# Altium schematic sheet PIC-ICSP-RST.SchDoc
size A4
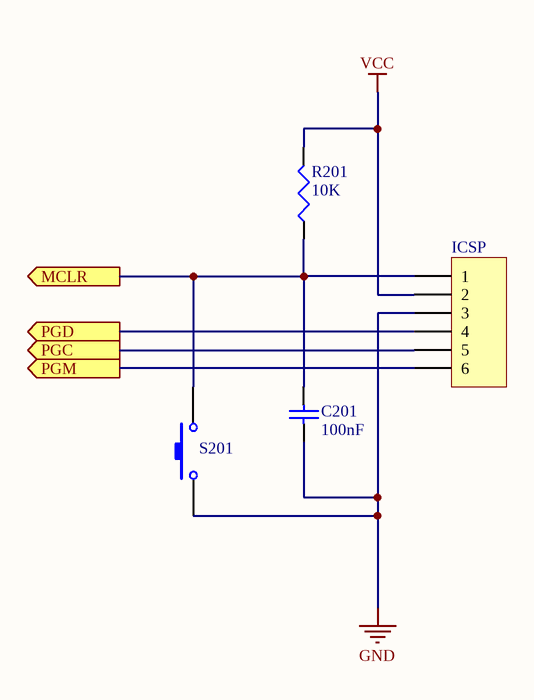
[diagram p0: PIC-ICSP-RST.SchDoc]

## Parts
C201  value 100nF  [RCL 0805]  (hidden comment: Cap Semi)
ICSP  Header 6  [MOLEX 22-23-2061]  (value not drawn)
R201  value 10K  [RCL 0805]  (hidden comment: Res3)
S201  Reset Switch  [Square SMD Switch 01]  (value not drawn)

## Ports
MCLR (out), PGC (out), PGD (out), PGM (out)

## Nets
GND: C201.1 ICSP.3 S201.1
VCC: ICSP.2 R201.2
MCLR: C201.2 ICSP.1 R201.1 S201.2 ; port MCLR
PGC: ICSP.5 ; port PGC
PGD: ICSP.4 ; port PGD
PGM: ICSP.6 ; port PGM

## Library data of the parts
C201 = Cap Semi: Capacitor (Semiconductor SIM Model); Published: 8-Jun-2000; LatestRevisionDate: 29-May-2009; LatestRevisionNote: IPC-7351 Footprint Added.; PackageReference: C1206; Publisher: Altium Limited; PackageDescription: Chip Capacitor
ICSP = Header 6: Header, 6-Pin; LatestRevisionDate: 17-Jul-2002; LatestRevisionNote: Re-released for DXP Platform.; Publisher: Altium Limited
R201 = Res3: Resistor; Published: 8-Jun-2000; LatestRevisionDate: 29-May-2009; LatestRevisionNote: IPC-7351 Footprint Added.; PackageReference: J1-0603; Publisher: Altium Limited; PackageDescription: Chip Resistor
S201 = SW-PB: Switch; Published: 24-Mar-1999; LatestRevisionDate: 17-Jul-2002; LatestRevisionNote: Re-released for DXP Platform.; PackageReference: SPST-2; Publisher: Altium Limited